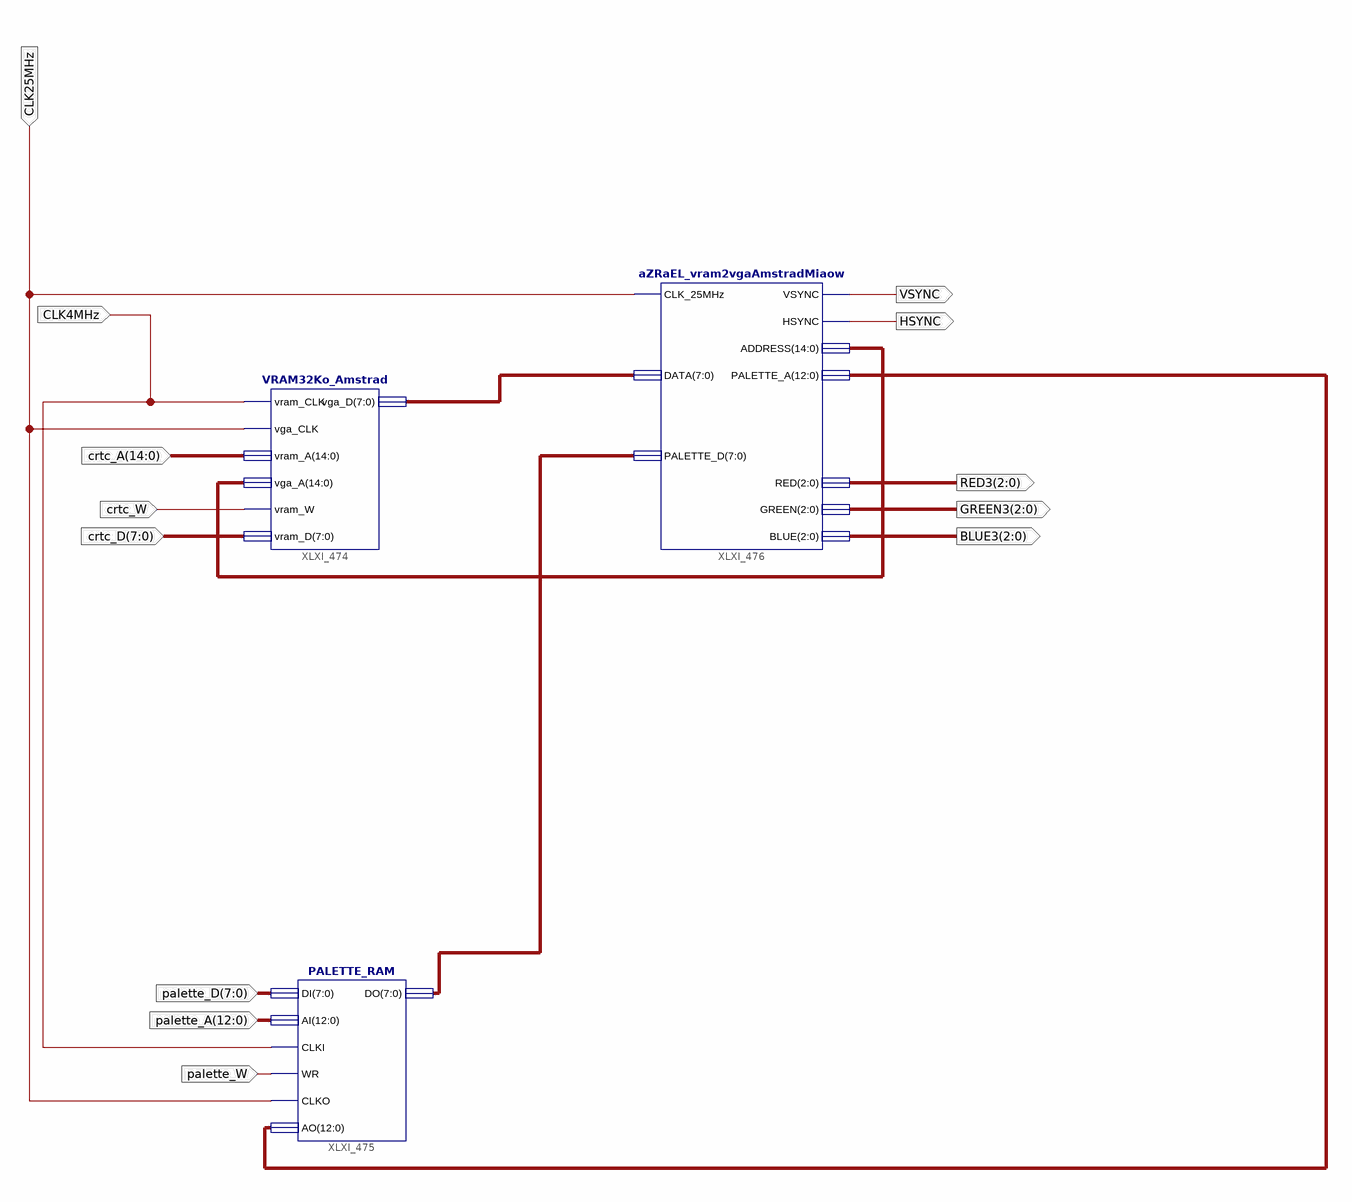
[diagram p0: schematic sheet 1]
// Xilinx ISE schematic amstrad_video.sch (spartan6) as structural Verilog: 3 symbols, 13 ports
module amstrad_video (
  input  crtc_W,
  input  [7:0] crtc_D,
  input  [14:0] crtc_A,
  input  CLK4MHz,
  input  CLK25MHz,
  input  [7:0] palette_D,
  input  [12:0] palette_A,
  input  palette_W,
  output HSYNC,
  output VSYNC,
  output [2:0] RED3,
  output [2:0] GREEN3,
  output [2:0] BLUE3
);

  wire [7:0] XLXN_684, XLXN_705;
  wire [12:0] XLXN_694;
  wire [14:0] XLXN_693;

  VRAM32Ko_Amstrad XLXI_474 (
    .vram_CLK(CLK4MHz), .vga_CLK(CLK25MHz), .vram_A(crtc_A), .vga_A(XLXN_693), .vram_W(crtc_W),
    .vram_D(crtc_D), .vga_D(XLXN_705));
  PALETTE_RAM XLXI_475 (
    .CLKI(CLK4MHz), .CLKO(CLK25MHz), .WR(palette_W), .AI(palette_A), .AO(XLXN_694), .DI(palette_D),
    .DO(XLXN_684));
  aZRaEL_vram2vgaAmstradMiaow XLXI_476 (
    .CLK_25MHz(CLK25MHz), .DATA(XLXN_705), .PALETTE_D(XLXN_684), .VSYNC(VSYNC), .HSYNC(HSYNC),
    .ADDRESS(XLXN_693), .PALETTE_A(XLXN_694), .RED(RED3), .GREEN(GREEN3), .BLUE(BLUE3));
endmodule
